# EAGLE schematic peripheral_devices_power_controller_board_v1.0 (EAGLE 9.5.1)
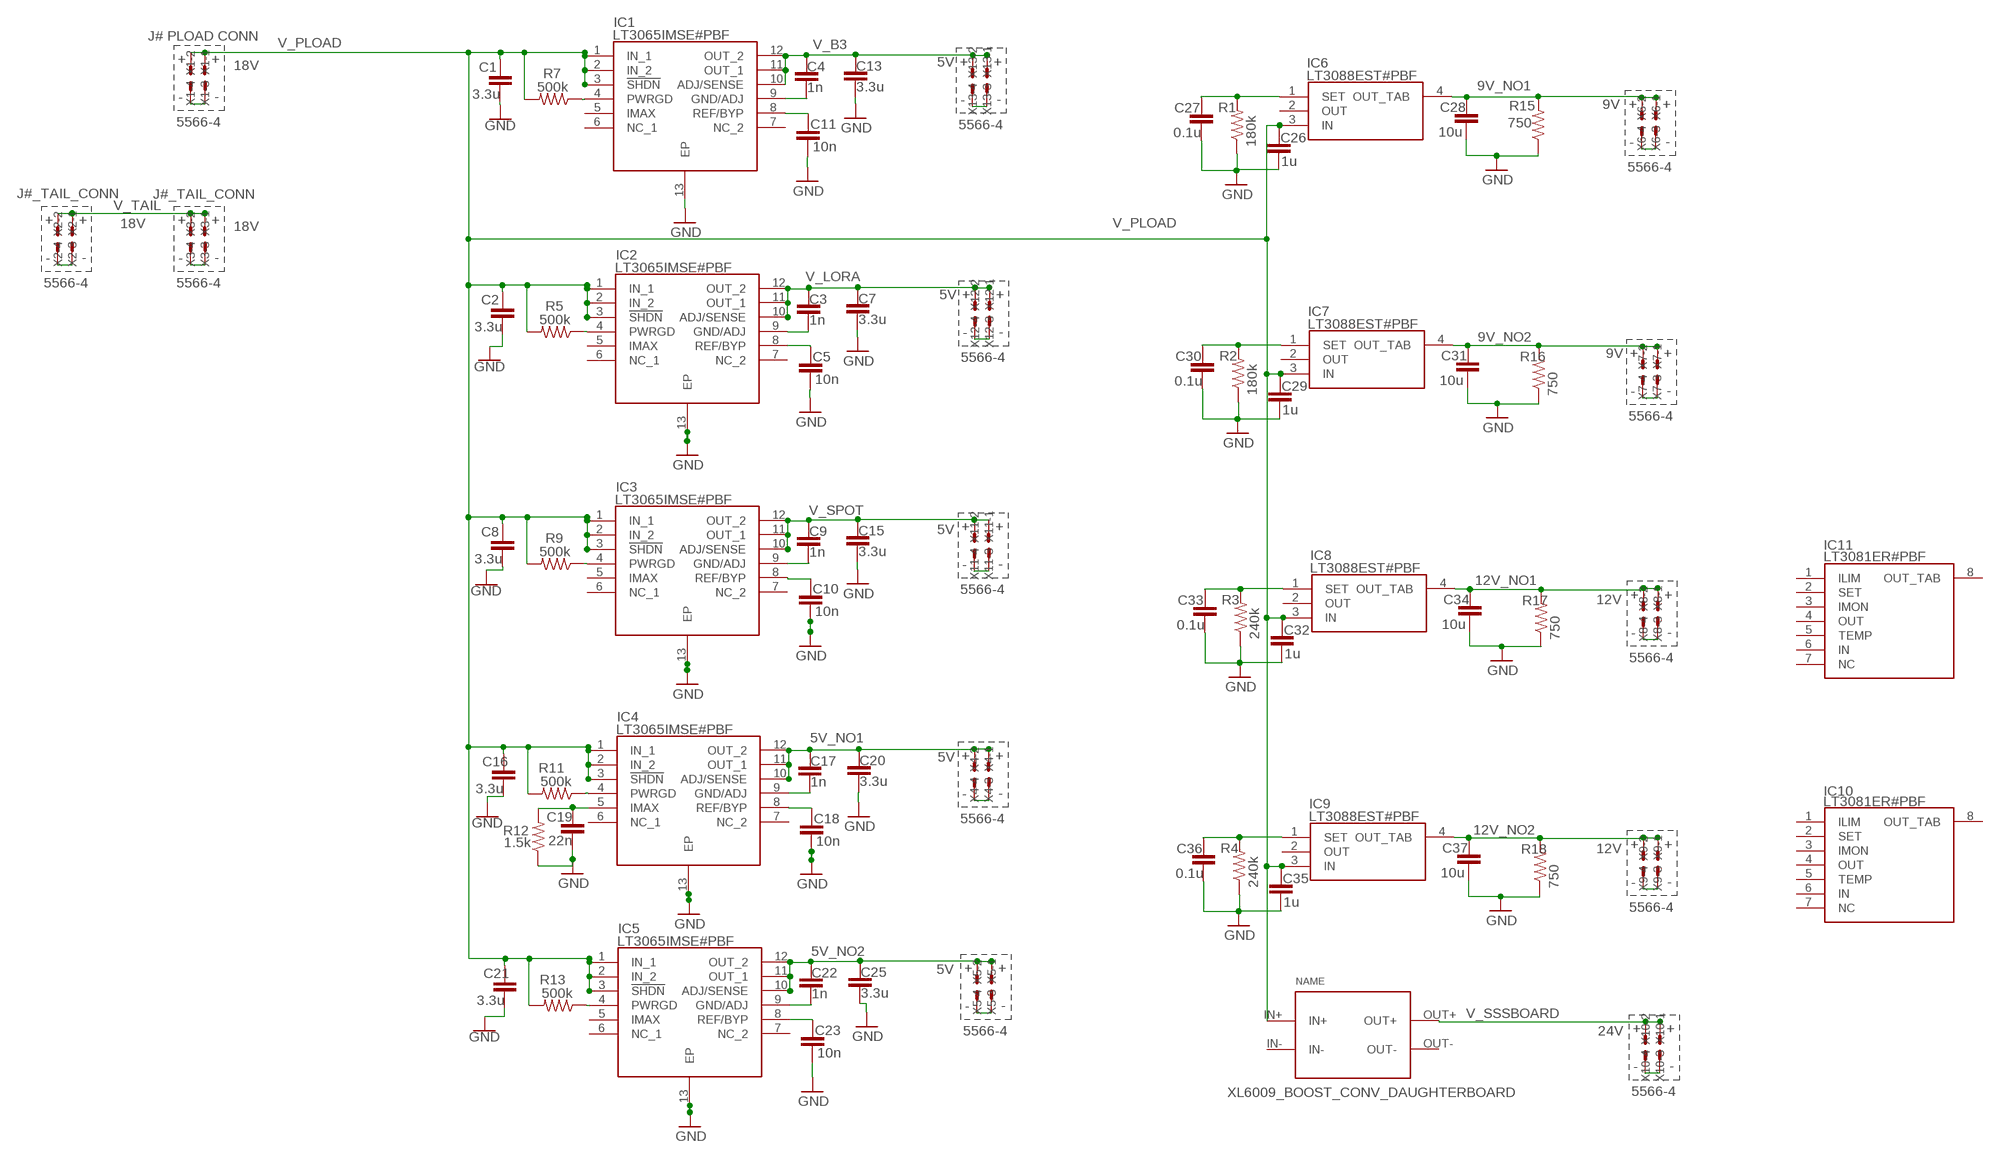
[diagram p0: schematic, sheet 1]

## Parts
C1  3.3u  C-EUC0805K  [C0805K]
C2  3.3u  C-EUC0805K  [C0805K]
C3  1n  C-EUC0805K  [C0805K]
C4  1n  C-EUC0805K  [C0805K]
C5  10n  C-EUC0805K  [C0805K]
C7  3.3u  C-EUC0805K  [C0805K]
C8  3.3u  C-EUC0805K  [C0805K]
C9  1n  C-EUC0805K  [C0805K]
C10  10n  C-EUC0805K  [C0805K]
C11  10n  C-EUC0805K  [C0805K]
C13  3.3u  C-EUC0805K  [C0805K]
C15  3.3u  C-EUC0805K  [C0805K]
C16  3.3u  C-EUC0805K  [C0805K]
C17  1n  C-EUC0805K  [C0805K]
C18  10n  C-EUC0805K  [C0805K]
C19  22n  C-EUC0805K  [C0805K]
C20  3.3u  C-EUC0805K  [C0805K]
C21  3.3u  C-EUC0805K  [C0805K]
C22  1n  C-EUC0805K  [C0805K]
C23  10n  C-EUC0805K  [C0805K]
C25  3.3u  C-EUC0805K  [C0805K]
C26  1u  C-EUC0805K  [C0805K]
C27  0.1u  C-EUC0805K  [C0805K]
C28  10u  C-EUC0805K  [C0805K]
C29  1u  C-EUC0805K  [C0805K]
C30  0.1u  C-EUC0805K  [C0805K]
C31  10u  C-EUC0805K  [C0805K]
C32  1u  C-EUC0805K  [C0805K]
C33  0.1u  C-EUC0805K  [C0805K]
C34  10u  C-EUC0805K  [C0805K]
C35  1u  C-EUC0805K  [C0805K]
C36  0.1u  C-EUC0805K  [C0805K]
C37  10u  C-EUC0805K  [C0805K]
IC1  LT3065IMSE#PBF  [SOP65P490X110-13N]
IC2  LT3065IMSE#PBF  [SOP65P490X110-13N]
IC3  LT3065IMSE#PBF  [SOP65P490X110-13N]
IC4  LT3065IMSE#PBF  [SOP65P490X110-13N]
IC5  LT3065IMSE#PBF  [SOP65P490X110-13N]
IC6  LT3088EST#PBF  [SOT230P700X180-4N]
IC7  LT3088EST#PBF  [SOT230P700X180-4N]
IC8  LT3088EST#PBF  [SOT230P700X180-4N]
IC9  LT3088EST#PBF  [SOT230P700X180-4N]
IC10  LT3081ER#PBF  [TO127P1394X457-8N]
IC11  LT3081ER#PBF  [TO127P1394X457-8N]
R1  180k  R-US_R0805  [R0805]
R2  180k  R-US_R0805  [R0805]
R3  240k  R-US_R0805  [R0805]
R4  240k  R-US_R0805  [R0805]
R5  500k  R-US_R0805  [R0805]
R7  500k  R-US_R0805  [R0805]
R9  500k  R-US_R0805  [R0805]
R11  500k  R-US_R0805  [R0805]
R12  1.5k  R-US_R0805  [R0805]
R13  500k  R-US_R0805  [R0805]
R15  750  R-US_R0805  [R0805]
R16  750  R-US_R0805  [R0805]
R17  750  R-US_R0805  [R0805]
R18  750  R-US_R0805  [R0805]
X1  5566-4  [5566-4]
X2  5566-4  [5566-4]
X3  5566-4  [5566-4]
X4  5566-4  [5566-4]
X5  5566-4  [5566-4]
X6  5566-4  [5566-4]
X7  5566-4  [5566-4]
X8  5566-4  [5566-4]
X9  5566-4  [5566-4]
X10  5566-4  [5566-4]
X11  5566-4  [5566-4]
X12  5566-4  [5566-4]
X13  5566-4  [5566-4]
XL6009_BOOST_CONV_DAUGHTERBOARD  CP8-ADJ  [CP8-ADJ]

## Nets
5V_NO1: C17.1 C20.1 IC4.10(ADJ/SENSE) IC4.11(OUT_1) IC4.12(OUT_2) X4.3 X4.4
5V_NO2: C22.1 C25.1 IC5.10(ADJ/SENSE) IC5.11(OUT_1) IC5.12(OUT_2) X5.3 X5.4
9V_NO1: C28.1 IC6.4(OUT_TAB) R15.2 X6.3 X6.4
9V_NO2: C31.1 IC7.4(OUT_TAB) R16.2 X7.3 X7.4
12V_NO1: C34.1 IC8.4(OUT_TAB) R17.2 X8.3 X8.4
12V_NO2: C37.1 IC9.4(OUT_TAB) R18.2 X9.3 X9.4
GND: C1.2 C2.2 C5.2 C7.2 C8.2 C10.2 C11.2 C13.2 C15.2 C16.2 C18.2 C19.2 C20.2 C21.2 C23.2 C25.2 C26.2 C27.2 C28.2 C29.2 C30.2 C31.2 C32.2 C33.2 C34.2 C35.2 C36.2 C37.2 IC1.13(EP) IC2.13(EP) IC3.13(EP) IC4.13(EP) IC5.13(EP) R1.1 R2.1 R3.1 R4.1 R12.1 R15.1 R16.1 R17.1 R18.1
N$1: C27.1 IC6.1(SET) R1.2
N$2: C30.1 IC7.1(SET) R2.2
N$3: X2.1 X2.2
N$4: C33.1 IC8.1(SET) R3.2
N$5: X3.1 X3.2
N$6: C5.1 IC2.8(REF/BYP)
N$7: IC1.4(PWRGD) R7.1
N$8: C4.2 IC1.9(GND/ADJ)
N$10: C11.1 IC1.8(REF/BYP)
N$11: X1.1 X1.2
N$12: IC2.4(PWRGD) R5.1
N$13: C3.2 IC2.9(GND/ADJ)
N$15: X4.1 X4.2
N$16: C10.1 IC3.8(REF/BYP)
N$18: IC3.4(PWRGD) R9.1
N$19: C9.2 IC3.9(GND/ADJ)
N$20: C36.1 IC9.1(SET) R4.2
N$21: C18.1 IC4.8(REF/BYP)
N$22: C19.1 IC4.5(IMAX) R12.2
N$23: IC4.4(PWRGD) R11.1
N$24: C17.2 IC4.9(GND/ADJ)
N$25: X5.1 X5.2
N$26: C23.1 IC5.8(REF/BYP)
N$28: IC5.4(PWRGD) R13.1
N$29: C22.2 IC5.9(GND/ADJ)
N$30: X6.1 X6.2
N$31: X7.1 X7.2
N$32: X8.1 X8.2
N$33: X9.1 X9.2
N$34: X10.1 X10.2
N$36: X11.1 X11.2
N$37: X12.1 X12.2
N$38: X13.1 X13.2
V_B3: C4.1 C13.1 IC1.10(ADJ/SENSE) IC1.11(OUT_1) IC1.12(OUT_2) X13.3 X13.4
V_LORA: C3.1 C7.1 IC2.10(ADJ/SENSE) IC2.11(OUT_1) IC2.12(OUT_2) X12.3 X12.4
V_PLOAD: C1.1 C2.1 C8.1 C16.1 C21.1 C26.1 C29.1 C32.1 C35.1 IC1.1(IN_1) IC1.2(IN_2) IC1.3(!SHDN) IC2.1(IN_1) IC2.2(IN_2) IC2.3(!SHDN) IC3.1(IN_1) IC3.2(IN_2) IC3.3(!SHDN) IC4.1(IN_1) IC4.2(IN_2) IC4.3(!SHDN) IC5.1(IN_1) IC5.2(IN_2) IC5.3(!SHDN) IC6.3(IN) IC7.3(IN) IC8.3(IN) IC9.3(IN) R5.2 R7.2 R9.2 R11.2 R13.2 X1.3 X1.4 XL6009_BOOST_CONV_DAUGHTERBOARD.IN+
V_SPOT: C9.1 C15.1 IC3.10(ADJ/SENSE) IC3.11(OUT_1) IC3.12(OUT_2) X11.3 X11.4
V_SSSBOARD: X10.3 X10.4 XL6009_BOOST_CONV_DAUGHTERBOARD.OUT+
V_TAIL: X2.3 X2.4 X3.3 X3.4
Unconnected: IC1.5(IMAX) IC1.6(NC_1) IC1.7(NC_2) IC2.5(IMAX) IC2.6(NC_1) IC2.7(NC_2) IC3.5(IMAX) IC3.6(NC_1) IC3.7(NC_2) IC4.6(NC_1) IC4.7(NC_2) IC5.5(IMAX) IC5.6(NC_1) IC5.7(NC_2) IC6.2(OUT) IC7.2(OUT) IC8.2(OUT) IC9.2(OUT) IC10.1(ILIM) IC10.2(SET) IC10.3(IMON) IC10.4(OUT) IC10.5(TEMP) IC10.6(IN) IC10.7(NC) IC10.8(OUT_TAB) IC11.1(ILIM) IC11.2(SET) IC11.3(IMON) IC11.4(OUT) IC11.5(TEMP) IC11.6(IN) IC11.7(NC) IC11.8(OUT_TAB) XL6009_BOOST_CONV_DAUGHTERBOARD.IN- XL6009_BOOST_CONV_DAUGHTERBOARD.OUT-

## Notes on the sheet
- J# PLOAD CONN
- + | + | 5V | + | +
- 18V
- - | - | - | -
- 9V | + | +
- - | -
- J#_TAIL_CONN | J#_TAIL_CONN
- + | + | 18V | + | +
- 18V
- - | - | - | -
- 5V | + | +
- - | -
- 9V | + | +
- - | -
- 5V | + | +
- - | -
- + | +
- 12V
- - | -
- 5V | + | +
- - | -
- + | +
- 12V
- - | -
- 5V | + | +
- - | -
- 24V | + | +
- - | -
- XL6009_BOOST_CONV_DAUGHTERBOARD

## Library data of the parts
C1-C5 C7-C11 C13 C15-C23 C25-C37 = rcl:C-EU: CAPACITOR, European symbol; SPICEPREFIX: C
IC1-IC5 = SamacSys_Parts:LT3065IMSE#PBF: LINEAR TECHNOLOGY - LT3065IMSE#PBF - LDO, ADJ O/P, 0.6V-40V, 0.5A, MSOP-12 Source: Datasheet <http://cds.linear.com/docs/en/datasheet/3065fb.pdf>; DESCRIPTION: LINEAR TECHNOLOGY - LT3065IMSE#PBF - LDO, ADJ O/P, 0.6V-40V, 0.5A, MSOP-12; HEIGHT: 1.1mm; MANUFACTURER_NAME: Linear Technology; MANUFACTURER_PART_NUMBER: LT3065IMSE#PBF; MOUSER_PART_NUMBER: 584-LT3065IMSE#PBF; MOUSER_PRICE-STOCK: https://www.mouser.com/Search/Refine.aspx?Keyword=584-LT3065IMSE%23PBF
IC6-IC9 = SamacSys_Parts:LT3088EST#PBF: 800mA Single Resistor Rugged Linear Regulator Source: Datasheet <http://cds.linear.com/docs/en/datasheet/3088fb.pdf>; DESCRIPTION: 800mA Single Resistor Rugged Linear Regulator; HEIGHT: 1.8mm; MANUFACTURER_NAME: Linear Technology; MANUFACTURER_PART_NUMBER: LT3088EST#PBF; MOUSER_PART_NUMBER: 584-LT3088EST#PBF; MOUSER_PRICE-STOCK: https://www.mouser.com/Search/Refine.aspx?Keyword=584-LT3088EST%23PBF
IC10 IC11 = LT3081ER#PBF:LT3081ER#PBF: 1.5A Single Resistor Rugged Linear Regulator with Monitors Source: Datasheet <http://cds.linear.com/docs/en/datasheet/3081fc.pdf>; DESCRIPTION: 1.5A Single Resistor Rugged Linear Regulator with Monitors; HEIGHT: 4.572mm; MANUFACTURER_NAME: Linear Technology; MANUFACTURER_PART_NUMBER: LT3081ER#PBF; MOUSER_PART_NUMBER: 584-LT3081ER#PBF; MOUSER_PRICE-STOCK: https://www.mouser.com/Search/Refine.aspx?Keyword=584-LT3081ER%23PBF
R1-R5 R7 R9 R11-R13 R15-R18 = rcl:R-US_: RESISTOR, American symbol; SPICEPREFIX: R
X1-X13 = con-molex:5566-4: Mini FIT connector 4 pol Source: http://www.molex.com; MF: MOLEX; OC_FARNELL: unknown; OC_NEWARK: unknown
XL6009_BOOST_CONV_DAUGHTERBOARD = userlib:CP8-ADJ: Voltage regulator IN: 7-35V OUT: ADJ